# Altium schematic sheet SpeakEasy_Buck.SchDoc
size A
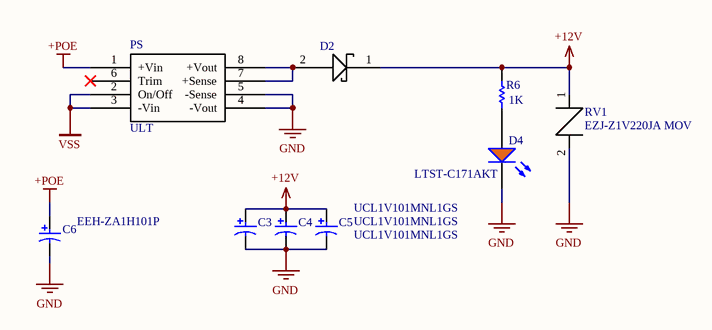
[diagram p0: SpeakEasy_Buck.SchDoc]

## Parts
C3  UCL1V101MNL1GS  [NIC-UCL1V101MNL1GS_L]
C4  UCL1V101MNL1GS  [NIC-UCL1V101MNL1GS_L]
C5  UCL1V101MNL1GS  [NIC-UCL1V101MNL1GS_L]
C6  EEH-ZA1H101P  [PNSC-ZA-G_L]
D2  Shottkey Diode  [DO-220AA]  (value not drawn)
D4  LTST-C171AKT  [LTST-C171AKT_V]
PS  ULT  [ULT-12/2.5]
R6  1k  [RESC0603(1608)_N]
RV1  EZJ-Z1V220JA MOV  [DIOC1608X06N]

## Nets
+12V: C3.1 C4.1 C5.1 D2.1(-) R6.2 RV1.1
+POE: C6.1 PS.1(+Vin)
GND: C3.2 C4.2 C5.2 C6.2 D4.C PS.4(-Vout) PS.5(-Sense) RV1.2
VSS: PS.2(On/Off) PS.3(-Vin)
NetD2_2: D2.2(+) PS.7(+Sense) PS.8(+Vout)
NetD4_A: D4.A R6.1

Not connected (* = marked no-connect by the designer): PS 6(Trim)*

## Library data of the parts
C3-C5 = CMP-2000-07344-1: Aluminum Electrolytic Capacitor, 100 uF, 35 V, 20%, -55 to 105 degC, 2-Pin SMD, RoHS, Tape and Reel; Manufacturer: Nichicon; Capacitance: 100uF; Dissipation Factor DF: 0.12; Case Diameter: 8mm; Ripple Current: 850mA; Type: AluminumElectrolyticCapacitors,ChipType,LowImpedance; Case Height: 8.3mm; Leakage Current: 3uA; Voltage Rating DC: 35V; Load Life: 2000h; Case Length: 10mm; Series: CL; Minimum Operating Temperature: -55C; Datasheet URL: http://datasheet.octopart.com/UCL1V101MNL1GS-Nichicon-datasheet-41194108.pdf; Manufacturer URL: http://www.nichicon.co.jp/english/; Maximum Operating Temperature: +105C; Package Reference: UCL1V101MNL1GS; Operating Temperature Range: -55Cto+105C; Brand: Nichicon; Package Description: 2-Pin Surface Mount Device, Body 8.3 x 8.3 mm, Height 10.8 mm; RoHS: Details; Voltage Rating: 35V; Dimensions: 8mmDia.x10mmLx8.3mmH; Termination Style: SMD/SMT; Datasheet Version: 01/2015; Packaging: Reel; Mounting Technology: SurfaceMount; Product Category: AluminumElectrolyticCapacitors-SMD; Factory Pack Quantity: 500; Product: LowImpedanceElectrolyticCapacitors; Tolerance: 20%
C6 = CMP-2000-06221-1: Conductive Polymer Hybrid Aluminum Electrolytic Capacitor, 100 uF, +/- 20%, 50 V, -55 to 105 degC, 2-Pin SMD (G), RoHS, Tape and Reel; Case Height: 10.5mm; Voltage Rating DC: 50V; Case Diameter: 10mm; Ripple Current: 2A; Load Life: 10000Hour; Brand: Panasonic; Case Length: 10.2mm; ESR: 28mOhms; Capacitance: 100uF; Manufacturer URL: http://www.panasonic.com/; Minimum Operating Temperature: -55C; Datasheet Version: 06/2016; Product Category: AluminumOrganicPolymerCapacitors; Maximum Operating Temperature: +105C; Package Description: 2-Pin Surface Mount Device, Body 10.3 x 10.3 mm; Package Reference: ZA-G; RoHS: Details; Series: ZA; Tolerance: 20%; Product: AluminumElectrolyticCapacitors; Factory Pack Quantity: 500; Manufacturer: Panasonic; Termination Style: SMD/SMT; Datasheet URL: https://industrial.panasonic.com/cdbs/www-data/pdf/RDD0000/DMD0000COL56.pdf; Mounting Technology: SurfaceMount; Packaging: Reel; Height: 10.5mm
D2 = V3P6: ComponentLink1Description: Datasheet; ComponentLink1URL: https://www.vishay.com/docs/89344/v3p6.pdf
D4 = CMP-1674-00004-3: LED AMBER CLR THIN 0805 SMD; Manufacturer: Lite-On; PartNumber: LTST-C171AKT; ComponentLink1URL: http://optoelectronics.liteon.com/upload/download/DS-22-99-0170/S_110_LTST-C171AKT.pdf; PackageReference: C171AKT; ComponentLink1Description: Datasheet
PS = ULT: +12V/2.5A DC/DC Converter, requires 36-75V input to power on.; ComponentLink1Description: Datasheet; ComponentLink1URL: https://power.murata.com/data/power/ult.pdf
R6 = CMP-1012-00122-1: Case-EIA: 0603; Tolerance: 5 %; Power: 0.1 W; Case-Metric: 1608; Value: 1K; Technology: SMT
RV1 = EZJ-Z1V220JA: Voltage Supression; ComponentLink1Description: Datasheet; ComponentLink1URL: https://industrial.panasonic.com/cdbs/www-data/pdf/AWC0000/AWC0000C55.pdf